# Altium project GpioPowerAddon.PrjPcb
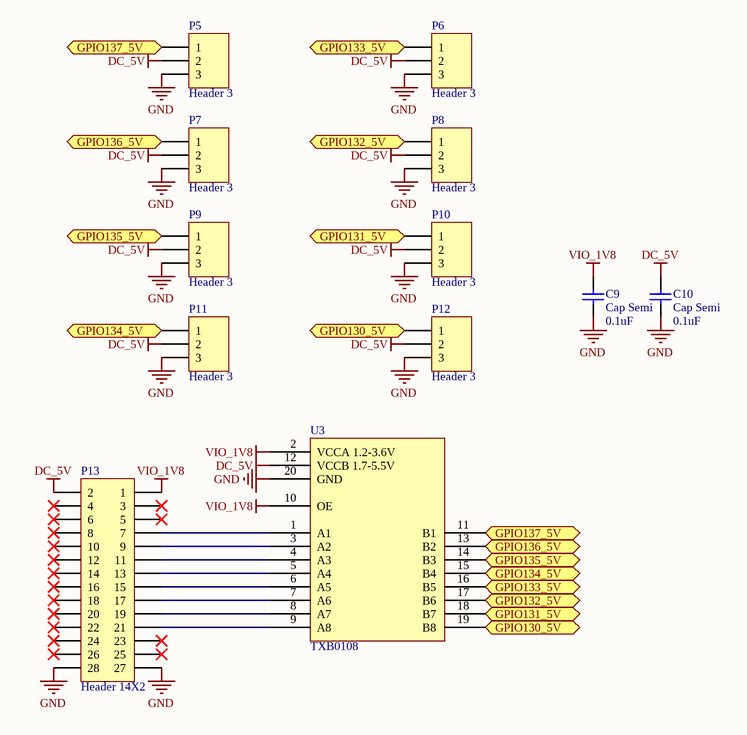
[diagram p0: VoltageLevelShifter.SchDoc]
1 sheet, 12 parts. Net scope: flat (ports and power ports of the same name join across sheets).
Board file: GpioPowerAddon.PcbDoc

## Sheet VoltageLevelShifter.SchDoc
size A

### Parts
C9  Cap Semi  value 0.1uF  [CAPC2012L]
C10  Cap Semi  value 0.1uF  [CAPC2012L]
P5  Header 3  [Connector Molex 3]
P6  Header 3  [Connector Molex 3]
P7  Header 3  [Connector Molex 3]
P8  Header 3  [Connector Molex 3]
P9  Header 3  [Connector Molex 3]
P10  Header 3  [Connector Molex 3]
P11  Header 3  [Connector Molex 3]
P12  Header 3  [Connector Molex 3]
P13  Header 14X2  [HDR2X14]
U3  TXB0108  [TSSOP20]

### Ports
GPIO130_5V (bidir), GPIO131_5V (bidir), GPIO132_5V (bidir), GPIO133_5V (bidir), GPIO134_5V (bidir), GPIO135_5V (bidir), GPIO136_5V (bidir), GPIO137_5V (bidir)

### Nets
DC_5V: C10.2 P5.2 P6.2 P7.2 P8.2 P9.2 P10.2 P11.2 P12.2 P13.2 U3.12(VCCB_1.7-5.5V)
GND: C9.1 C10.1 P5.3 P6.3 P7.3 P8.3 P9.3 P10.3 P11.3 P12.3 P13.27 P13.28 U3.20(GND)
VIO_1V8: C9.2 P13.1 U3.2(VCCA_1.2-3.6V) U3.10(OE)
NetP5_1: P5.1 U3.11(B1) ; port GPIO137_5V
NetP6_1: P6.1 U3.16(B5) ; port GPIO133_5V
NetP7_1: P7.1 U3.13(B2) ; port GPIO136_5V
NetP8_1: P8.1 U3.17(B6) ; port GPIO132_5V
NetP9_1: P9.1 U3.14(B3) ; port GPIO135_5V
NetP10_1: P10.1 U3.18(B7) ; port GPIO131_5V
NetP11_1: P11.1 U3.15(B4) ; port GPIO134_5V
NetP12_1: P12.1 U3.19(B8) ; port GPIO130_5V
NetP13_7: P13.7 U3.1(A1)
NetP13_9: P13.9 U3.3(A2)
NetP13_11: P13.11 U3.4(A3)
NetP13_13: P13.13 U3.5(A4)
NetP13_15: P13.15 U3.6(A5)
NetP13_17: P13.17 U3.7(A6)
NetP13_19: P13.19 U3.8(A7)
NetP13_21: P13.21 U3.9(A8)

Not connected (* = marked no-connect by the designer): P13 3* 4* 5* 6* 8* 10* 12* 14* 16* 18* 20* 22* 23* 24* 25* 26*

### Library data of the parts
C9 C10 = Cap Semi: Capacitor (Semiconductor SIM Model); Published: 8-Jun-2000; LatestRevisionDate: 29-May-2009; LatestRevisionNote: IPC-7351 Footprint Added.; PackageReference: C1206; Publisher: Altium Limited; PackageDescription: Chip Capacitor
P5-P12 = Header 3: Header, 3-Pin; LatestRevisionDate: 17-Jul-2002; LatestRevisionNote: Re-released for DXP Platform.; Publisher: Altium Limited
P13 = Header 14X2: Header, 14-Pin, Dual row; LatestRevisionDate: 17-Jul-2002; LatestRevisionNote: Re-released for DXP Platform.; Publisher: Altium Limited
U3 = TXB0108: Voltage Level Shifter